# EAGLE design DigiDash (EAGLE 9.6.2)
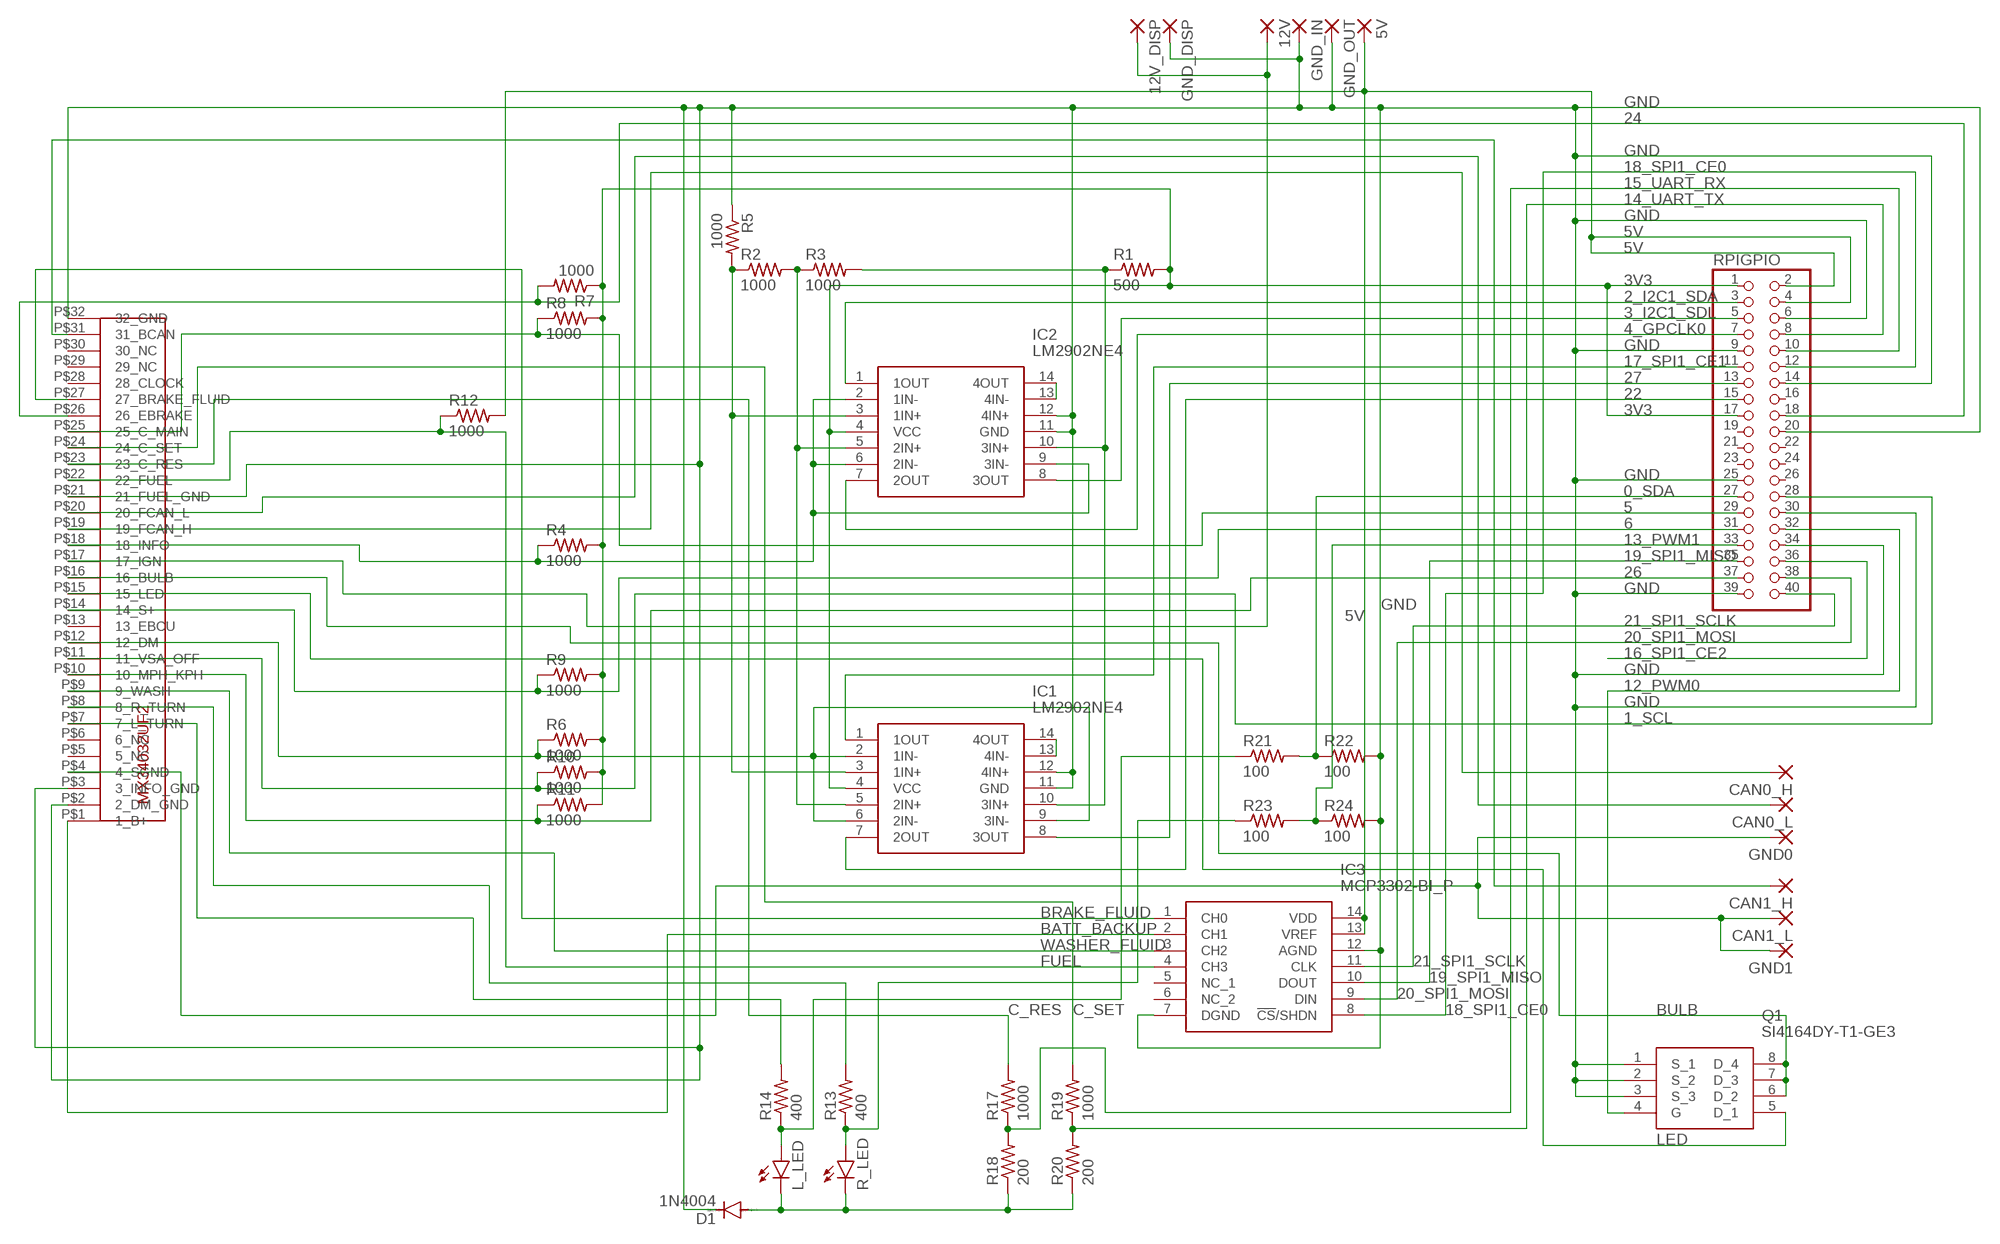
[diagram p0: schematic, sheet 1]

## Parts
5V  3,81/1,4  [3,81/1,4]
12V  3,81/1,4  [3,81/1,4]
12V_DISP  3,81/1,4  [3,81/1,4]
CAN0_H  3,81/1,4  [3,81/1,4]
CAN0_L  3,81/1,4  [3,81/1,4]
CAN1_H  3,81/1,4  [3,81/1,4]
CAN1_L  3,81/1,4  [3,81/1,4]
D1  1N4004  [DO41-10]
GND0  3,81/1,4  [3,81/1,4]
GND1  3,81/1,4  [3,81/1,4]
GND_DISP  3,81/1,4  [3,81/1,4]
GND_IN  3,81/1,4  [3,81/1,4]
GND_OUT  3,81/1,4  [3,81/1,4]
IC1  LM2902NE4  [DIP794W53P254L1930H508Q14N]
IC2  LM2902NE4  [DIP794W53P254L1930H508Q14N]
IC3  MCP3302-BI_P  [DIP781W56P254L1918H533Q14N]
L_LED  LED3MM  [LED3MM]
Q1  SI4164DY-T1-GE3  [SOIC127P600X175-8N]
R1  500  R-US_0204/7  [0204/7]
R2  1000  R-US_0204/7  [0204/7]
R3  1000  R-US_0204/7  [0204/7]
R4  1000  R-US_0204/7  [0204/7]
R5  1000  R-US_0204/7  [0204/7]
R6  1000  R-US_0204/7  [0204/7]
R7  1000  R-US_0204/7  [0204/7]
R8  1000  R-US_0204/7  [0204/7]
R9  1000  R-US_0204/7  [0204/7]
R10  1000  R-US_0204/7  [0204/7]
R11  1000  R-US_0204/7  [0204/7]
R12  1000  R-US_0204/7  [0204/7]
R13  400  R-US_0204/7  [0204/7]
R14  400  R-US_0204/7  [0204/7]
R17  1000  R-US_0204/7  [0204/7]
R18  200  R-US_0204/7  [0204/7]
R19  1000  R-US_0204/7  [0204/7]
R20  200  R-US_0204/7  [0204/7]
R21  100  R-US_0204/7  [0204/7]
R22  100  R-US_0204/7  [0204/7]
R23  100  R-US_0204/7  [0204/7]
R24  100  R-US_0204/7  [0204/7]
R_LED  LED3MM  [LED3MM]
RPIGPIO  PINHD-2X20  [2X20]
U$1  MX34032UF2  [MX34032UF2]

## Nets
0_SDA: R21.2 R22.1 RPIGPIO.27
1_SCL: R10.1 RPIGPIO.28 U$1.P$11(11_VSA_OFF)
2_I2C1_SDA: IC2.1(1OUT) RPIGPIO.3
3_I2C1_SDL: IC2.8(3OUT) RPIGPIO.5
3V3: IC1.4(VCC) IC2.4(VCC) R1.2 R4.2 R6.2 R7.1 R8.2 R9.2 R10.2 R11.2 RPIGPIO.1 RPIGPIO.17
4_GPCLK0: IC2.7(2OUT) RPIGPIO.7
5: R8.1 RPIGPIO.29 U$1.P$25(25_C_MAIN)
5V: 5V.1(P) IC3.13(VREF) IC3.14(VDD) R12.2 RPIGPIO.2 RPIGPIO.4
6: R9.1 RPIGPIO.31 U$1.P$14(14_S+)
12_PWM0: Q1.4(G) RPIGPIO.32
13_PWM1: R23.2 R24.1 RPIGPIO.33
14_UART_TX: R19.1 R20.2 RPIGPIO.8
15_UART_RX: R17.1 R18.2 RPIGPIO.10
16_SPI1_CE2: RPIGPIO.36
17_SPI1_CE1: IC1.1(1OUT) RPIGPIO.11
18_SPI1_CE0: IC3.8(!CS!/SHDN) RPIGPIO.12
19_SPI1_MISO: IC3.10(DOUT) RPIGPIO.35
20_SPI1_MOSI: IC3.9(DIN) RPIGPIO.38
21_SPI1_SCLK: IC3.11(CLK) RPIGPIO.40
22: IC1.7(2OUT) RPIGPIO.15
24: R7.2 RPIGPIO.18 U$1.P$26(26_EBRAKE)
26: R11.1 RPIGPIO.37 U$1.P$10(10_MPH_KPH)
27: IC1.8(3OUT) RPIGPIO.13
BATT_BACKUP: IC3.2(CH1) U$1.P$1(1_B+)
BRAKE_FLUID: IC3.1(CH0) U$1.P$27(27_BRAKE_FLUID)
BULB: Q1.6(D_2) Q1.7(D_3) Q1.8(D_4) U$1.P$16(16_BULB)
C_RES: R17.2 U$1.P$23(23_C_RES)
C_SET: R19.2 U$1.P$24(24_C_SET)
FUEL: IC3.4(CH3) R12.1 U$1.P$22(22_FUEL)
GND: D1.C GND_DISP.1(P) GND_IN.1(P) GND_OUT.1(P) IC1.11(GND) IC1.12(4IN+) IC2.11(GND) IC2.12(4IN+) IC3.7(DGND) IC3.12(AGND) Q1.1(S_1) Q1.2(S_2) Q1.3(S_3) R5.1 R22.2 R24.2 RPIGPIO.6 RPIGPIO.9 RPIGPIO.14 RPIGPIO.20 RPIGPIO.25 RPIGPIO.30 RPIGPIO.34 RPIGPIO.39 U$1.P$2(2_DM_GND) U$1.P$3(3_INFO_GND) U$1.P$21(21_FUEL_GND) U$1.P$32(32_GND)
LED: Q1.5(D_1) U$1.P$15(15_LED)
N$1: IC1.2(1IN-) IC1.6(2IN-) IC1.9(3IN-) R6.1 U$1.P$12(12_DM)
N$2: R14.2 U$1.P$7(7_L_TURN)
N$3: IC1.10(3IN+) IC2.10(3IN+) R1.1 R3.2
N$4: IC1.3(1IN+) IC2.3(1IN+) R2.1 R5.2
N$5: IC2.13(4IN-) IC2.14(4OUT)
N$6: IC1.5(2IN+) IC2.5(2IN+) R2.2 R3.1
N$7: IC1.13(4IN-) IC1.14(4OUT)
N$8: CAN1_H.1(P) U$1.P$31(31_BCAN)
N$9: CAN1_L.1(P) GND0.1(P) GND1.1(P) U$1.P$4(4_SGND)
N$10: CAN0_H.1(P) U$1.P$19(19_FCAN_H)
N$11: CAN0_L.1(P) U$1.P$20(20_FCAN_L)
N$12: R13.2 U$1.P$8(8_R_TURN)
N$13: IC2.2(1IN-) IC2.6(2IN-) IC2.9(3IN-) R4.1 U$1.P$18(18_INFO)
N$16: D1.A L_LED.K(C) R18.1 R20.1 R_LED.K(C)
N$17: 12V.1(P) 12V_DISP.1(P) U$1.P$17(17_IGN)
N$100: R13.1 R23.1 R_LED.A
N$101: L_LED.A R14.1 R21.1
WASHER_FLUID: IC3.3(CH2) U$1.P$9(9_WASH)
Unconnected: IC3.5(NC_1) IC3.6(NC_2) RPIGPIO.16 RPIGPIO.19 RPIGPIO.21 RPIGPIO.22 RPIGPIO.23 RPIGPIO.24 RPIGPIO.26 U$1.P$5(5_NC) U$1.P$6(6_NC) U$1.P$13(13_EBCU) U$1.P$28(28_CLOCK) U$1.P$29(29_NC) U$1.P$30(30_NC)

## Library data of the parts
5V 12V 12V_DISP CAN0_H CAN0_L CAN1_H CAN1_L GND0 GND1 GND_DISP GND_IN GND_OUT = wirepad:3,81/1,4: THROUGH-HOLE PAD
D1 = diode:1N4004: DIODE general purpose rectifier, 1 A
IC1 IC2 = SamacSys_Parts:LM2902NE4: Quadruple general-purpose operational amplifier Source: Datasheet <http://www.ti.com/lit/gpn/LM2902>; DESCRIPTION: Quadruple general-purpose operational amplifier<br />&nbsp;; HEIGHT: 5.08mm; MANUFACTURER_NAME: Texas Instruments; MANUFACTURER_PART_NUMBER: LM2902NE4; MOUSER_PART_NUMBER: 595-LM2902NE4; MOUSER_PRICE-STOCK: https://www.mouser.co.uk/ProductDetail/Texas-Instruments/LM2902NE4?qs=VBduBm9rCJQsy5MPoqo4Xw%3D%3D
IC3 = SamacSys_Parts:MCP3302-BI_P: Microchip MCP3302-BI/P, 13 bit Serial ADC, Differential Input, 14-Pin PDIP Source: Datasheet <https://ww1.microchip.com/downloads/aemDocuments/documents/APID/ProductDocuments/DataSheets/21697F.pdf>; ARROW_PART_NUMBER: MCP3302-BI/P; ARROW_PRICE-STOCK: https://www.arrow.com/en/products/mcp3302-bip/microchip-technology?region=nac; DESCRIPTION: Microchip MCP3302-BI/P, 13 bit Serial ADC, Differential Input, 14-Pin PDIP; HEIGHT: 5.334mm; MANUFACTURER_NAME: Microchip; MANUFACTURER_PART_NUMBER: MCP3302-BI/P; MOUSER_PART_NUMBER: 579-MCP3302-BI/P; MOUSER_PRICE-STOCK: https://www.mouser.co.uk/ProductDetail/Microchip-Technology/MCP3302-BI-P?qs=V0aAF6KYZrOlN7qFA8B5VA%3D%3D
L_LED R_LED = led:LED: LED OSRAM: - CHIPLED LG R971, LG N971, LY N971, LG Q971, LY Q971, LO R971, LY R971 LH N974, LH R974 LS Q976, LO Q976, LY Q976 LO Q996 - Hyper CHIPLED LW Q18S LB Q993, LB Q99A, LB R99A - SideLED LS A670, LO A670, LY A670, LG A670, LP A670 LB A673, LV A673, LT A673, LW A673 LH A674 LY A675 LS A676, LA A676, LO A676, LY A676, LW A676 LS A679, LY A679, LG A679 - Hyper Micro SIDELED® LS Y876, LA Y876, LO Y876, LY Y876 LT Y87S - SmartLED LW L88C, LW L88S LB L89C, LB L89S, LG L890 LS L89K, LO L89K, LY L89K LS L896, LA L896, LO L896, LY L896 - TOPLED LS T670, LO T670, LY T670, LG T670, LP T670 LSG T670, LSP T670, LSY T670, LOP T670, LYG T670 LG T671, LOG T671, LSG T671 LB T673, LV T673, LT T673, LW T673 LH T674 LS T676, LA T676, LO T676, LY T676, LB T676, LH T676, LSB T676, LW T676 LB T67C, LV T67C, LT T67C, LS T67K, LO T67K, LY T67K, LW E67C LS E67B, LA E67B, LO E67B, LY E67B, LB E67C, LV E67C, LT E67C LW T67C LS T679, LY T679, LG T679 LS T770, LO T770, LY T770, LG T770, LP T770 LB T773, LV T773, LT T773, LW T773 LH T774 LS E675, LA E675, LY E675, LS T675 LS T776, LA T776, LO T776, LY T776, LB T776 LHGB T686 LT T68C, LB T68C - Hyper Mini TOPLED® LB M676 - Mini TOPLED Santana® LG M470 LS M47K, LO M47K, LY M47K Source: http://www.osram.convergy.de LUXEON: - LUMILED® LXK2-PW12-R00, LXK2-PW12-S00, LXK2-PW14-U00, LXK2-PW14-V00 LXK2-PM12-R00, LXK2-PM12-S00, LXK2-PM14-U00 LXK2-PE12-Q00, LXK2-PE12-R00, LXK2-PE12-S00, LXK2-PE14-T00, LXK2-PE14-U00 LXK2-PB12-K00, LXK2-PB12-L00, LXK2-PB12-M00, LXK2-PB14-N00, LXK2-PB14-P00, LXK2-PB14-Q00 LXK2-PR12-L00, LXK2-PR12-M00, LXK2-PR14-Q00, LXK2-PR14-R00 LXK2-PD12-Q00, LXK2-PD12-R00, LXK2-PD12-S00 LXK2-PH12-R00, LXK2-PH12-S00 LXK2-PL12-P00, LXK2-PL12-Q00, LXK2-PL12-R00 Source: www.luxeon.com KINGBRIGHT: KA-3528ASYC Source: www.kingbright.com
Q1 = SamacSys_Parts:SI4164DY-T1-GE3: Vishay SI4164DY-T1-GE3 N-channel MOSFET Transistor, 30 A, 30 V, 8-Pin SOIC Source: Datasheet; DESCRIPTION: Vishay SI4164DY-T1-GE3 N-channel MOSFET Transistor, 30 A, 30 V, 8-Pin SOIC; HEIGHT: 1.75mm; MANUFACTURER_NAME: Vishay; MANUFACTURER_PART_NUMBER: SI4164DY-T1-GE3; MOUSER_PART_NUMBER: 781-SI4164DY-T1-GE3; MOUSER_PRICE-STOCK: https://www.mouser.co.uk/ProductDetail/Vishay-Semiconductors/SI4164DY-T1-GE3?qs=IRuQNBqMOcmOtrv2pb5m1A%3D%3D
R1-R14 R17-R24 = rcl:R-US_: RESISTOR, American symbol; SPICEPREFIX: R
RPIGPIO = pinhead:PINHD-2X20: PIN HEADER
U$1 = Custom:MX34032UF2

## Board
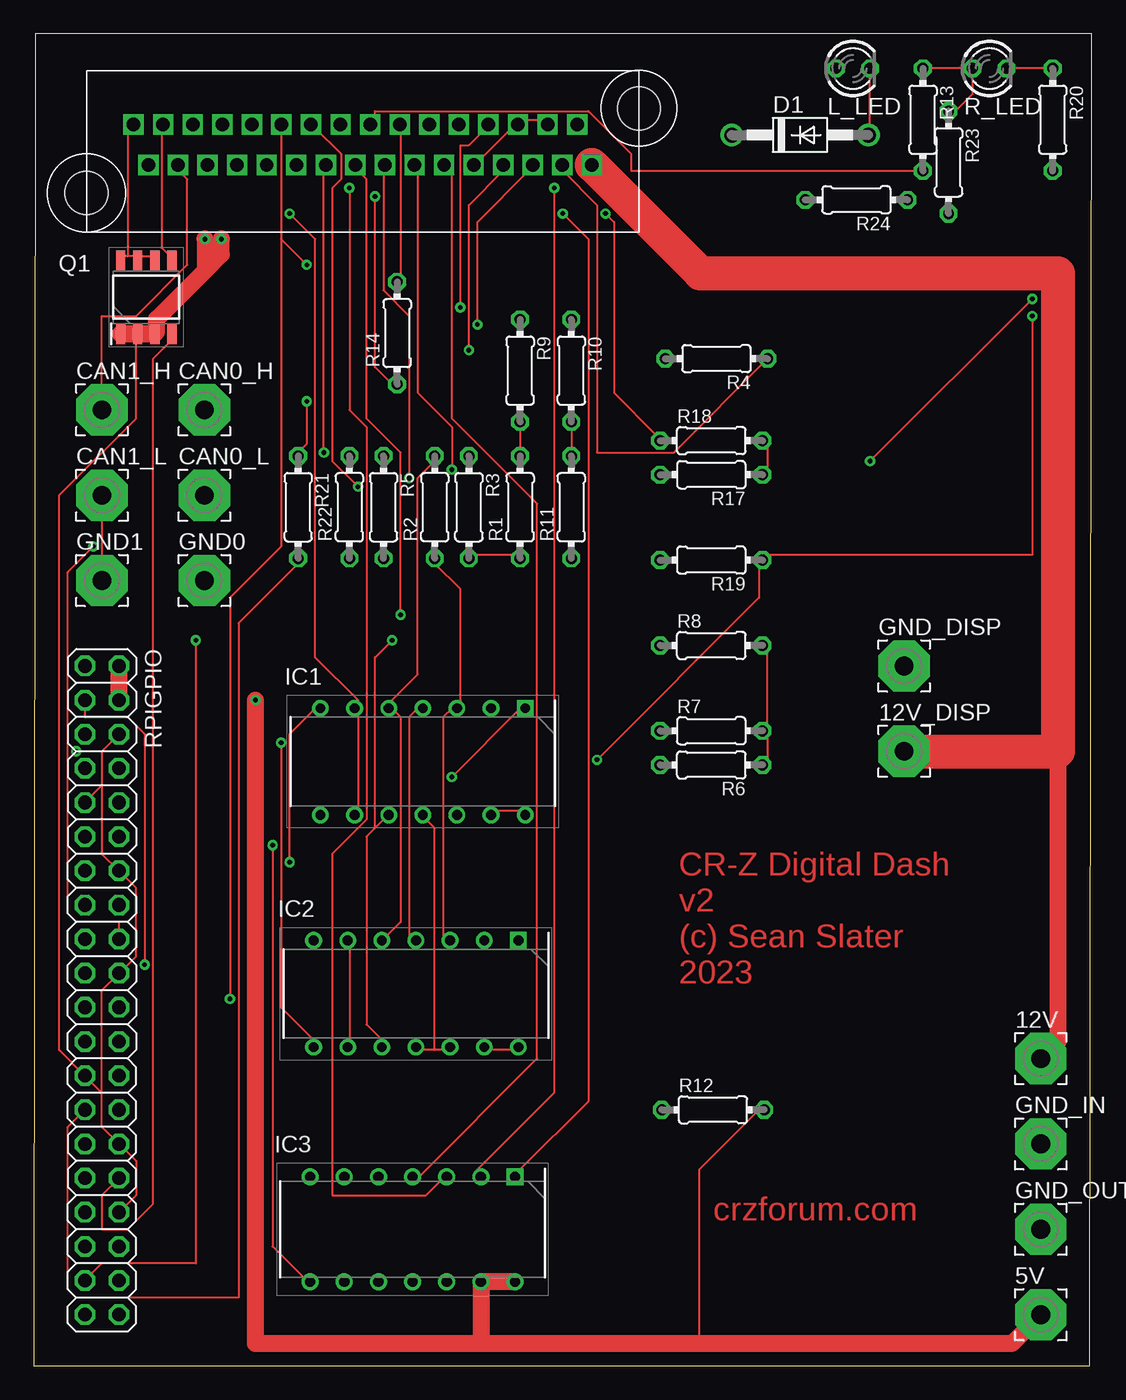
[diagram p1: board, top side]
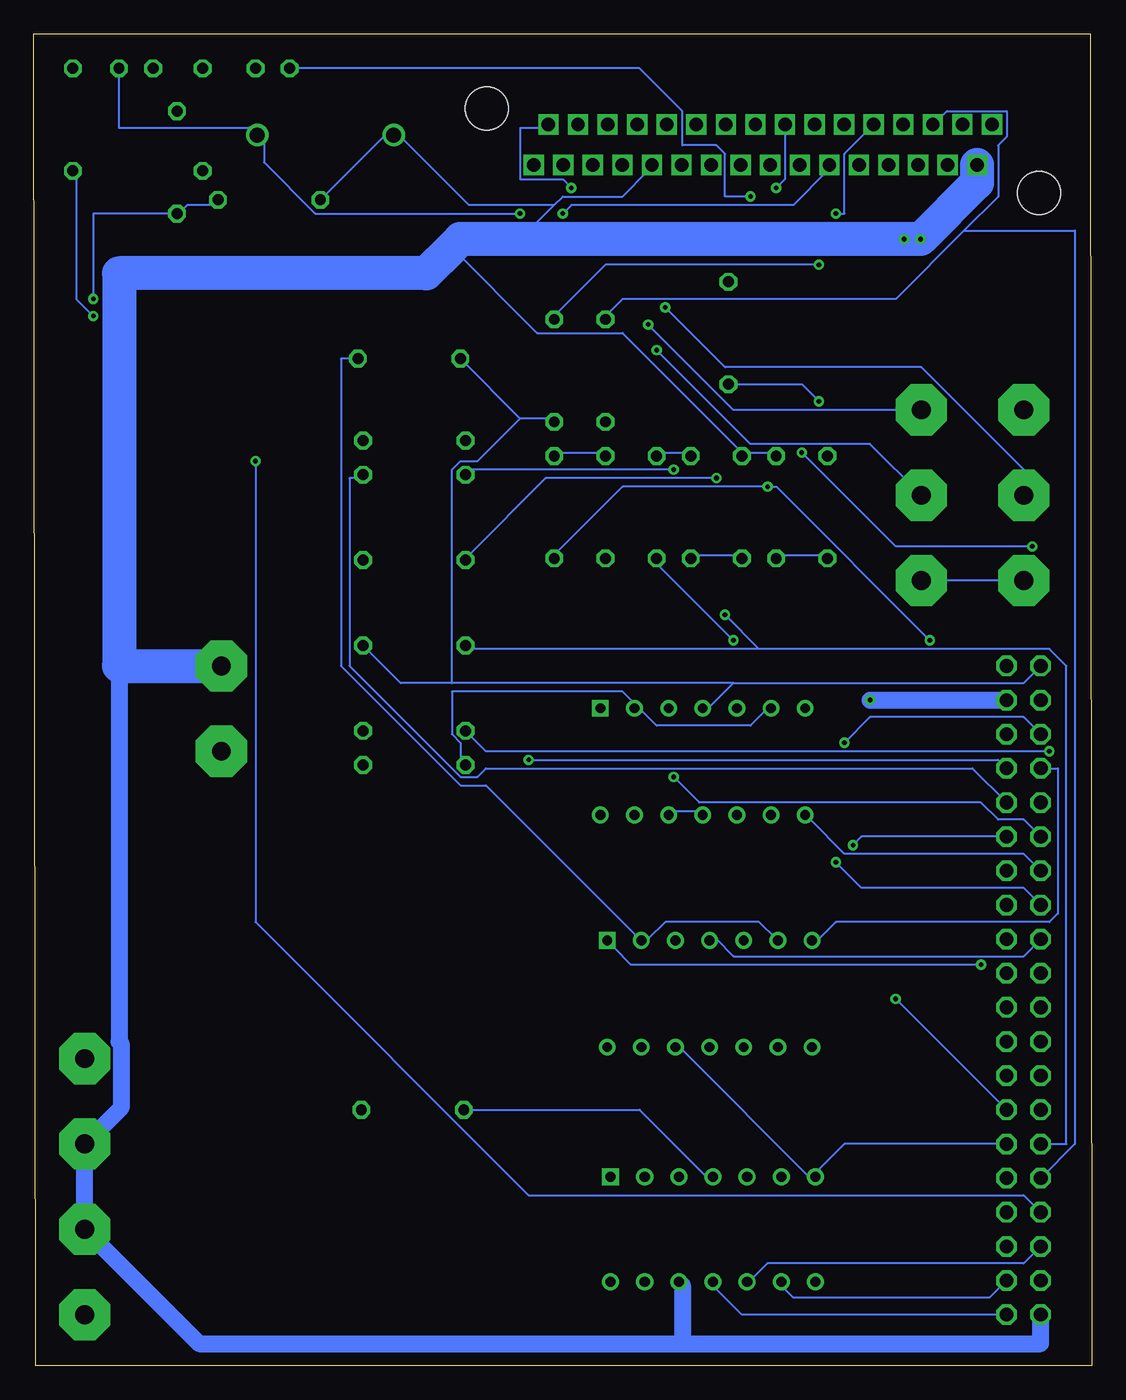
[diagram p2: board, bottom side, seen from below]

Size 78.72 x 99.11 mm. Coordinates in mm from the lower left corner, seen from the top.
Outline: 0,0 78.59,0 78.72,99.11 0.13,99.11 0,0
Copper layers (1*16): Top 0.035mm / dielectric 1.5mm / Bottom 0.035mm
Design rules "default": minimum track width 6mil, minimum drill 0.35mm, track to track 6mil, track to pad 6mil, pad to pad 6mil, via to via 6mil, smd to smd 6mil, copper to edge 40mil, drill to drill 6mil, minimum pad ring 10mil, minimum via ring 8mil, stop-mask expansion 4mil, vias tented up to drill 0mil, thermal gap 10mil

### Footprints (pad centres in the part's own frame; a part is rotated, then mirrored left to right if it is on the bottom)
3,81/1,4 = drill 1.397 pad 3.81 octagon: 1 0,0
DO41-10 = drill 1.118: A 5.08,0; C -5.08,0
DIP794W53P254L1930H508Q14N = drill 0.73 pad 1.13 square: 1 -3.97,7.62 | drill 0.73 pad 1.13: 2 -3.97,5.08; 3 -3.97,2.54; 4 -3.97,0; 5 -3.97,-2.54; 6 -3.97,-5.08; 7 -3.97,-7.62; 8 3.97,-7.62; 9 3.97,-5.08; 10 3.97,-2.54; 11 3.97,0; 12 3.97,2.54; 13 3.97,5.08; 14 3.97,7.62
DIP781W56P254L1918H533Q14N = drill 0.759 pad 1.159 square: 1 -3.905,7.62 | drill 0.759 pad 1.159: 2 -3.905,5.08; 3 -3.905,2.54; 4 -3.905,0; 5 -3.905,-2.54; 6 -3.905,-5.08; 7 -3.905,-7.62; 8 3.905,-7.62; 9 3.905,-5.08; 10 3.905,-2.54; 11 3.905,0; 12 3.905,2.54; 13 3.905,5.08; 14 3.905,7.62
LED3MM = drill 0.813 octagon: A -1.27,0; K 1.27,0
SOIC127P600X175-8N = smd 1.525 x 0.7: 1 -2.712,1.905; 2 -2.712,0.635; 3 -2.712,-0.635; 4 -2.712,-1.905; 5 2.712,-1.905; 6 2.712,-0.635; 7 2.712,0.635; 8 2.712,1.905
0204/7 = drill 0.813 octagon: 1 -3.81,0; 2 3.81,0
2X20 = drill 1.016 octagon: 1 -24.13,-1.27; 2 -24.13,1.27; 3 -21.59,-1.27; 4 -21.59,1.27; 5 -19.05,-1.27; 6 -19.05,1.27; 7 -16.51,-1.27; 8 -16.51,1.27; 9 -13.97,-1.27; 10 -13.97,1.27; 11 -11.43,-1.27; 12 -11.43,1.27; 13 -8.89,-1.27; 14 -8.89,1.27; 15 -6.35,-1.27; 16 -6.35,1.27; 17 -3.81,-1.27; 18 -3.81,1.27; 19 -1.27,-1.27; 20 -1.27,1.27; 21 1.27,-1.27; 22 1.27,1.27; 23 3.81,-1.27; 24 3.81,1.27; 25 6.35,-1.27; 26 6.35,1.27; 27 8.89,-1.27; 28 8.89,1.27; 29 11.43,-1.27; 30 11.43,1.27; 31 13.97,-1.27; 32 13.97,1.27; 33 16.51,-1.27; 34 16.51,1.27; 35 19.05,-1.27; 36 19.05,1.27; 37 21.59,-1.27; 38 21.59,1.27; 39 24.13,-1.27; 40 24.13,1.27
MX34032UF2 = drill 1 square: P$1 36.5,5.1; P$2 34.3,5.1; P$3 32.1,5.1; P$4 29.9,5.1; P$5 27.7,5.1; P$6 25.5,5.1; P$7 23.3,5.1; P$8 21.1,5.1; P$9 18.9,5.1; P$10 16.7,5.1; P$11 14.5,5.1; P$12 12.3,5.1; P$13 10.1,5.1; P$14 7.9,5.1; P$15 5.7,5.1; P$16 3.5,5.1; P$17 37.6,2.1; P$18 35.4,2.1; P$19 33.2,2.1; P$20 31,2.1; P$21 28.8,2.1; P$22 26.6,2.1; P$23 24.4,2.1; P$24 22.2,2.1; P$25 20,2.1; P$26 17.8,2.1; P$27 15.6,2.1; P$28 13.4,2.1; P$29 11.2,2.1; P$30 9,2.1; P$31 6.8,2.1; P$32 4.6,2.1 | hole 3.2: 41.1,6.3; 0,0

### Placement (x,y rotation side)
5V  74.93,3.81 0 top
12V  74.93,22.86 0 top
12V_DISP  64.77,45.72 0 top
CAN0_H  12.7,71.12 0 top
CAN0_L  12.7,64.77 0 top
CAN1_H  5.08,71.12 0 top
CAN1_L  5.08,64.77 0 top
D1  57.02,91.57 0 top
GND0  12.7,58.42 0 top
GND1  5.08,58.42 0 top
GND_DISP  64.77,52.07 0 top
GND_IN  74.93,16.51 0 top
GND_OUT  74.93,10.16 0 top
IC1  28.96,44.96 270 top
IC2  28.45,27.69 270 top
IC3  28.19,10.16 270 top
L_LED  60.96,96.52 0 top
Q1  8.38,79.5 90 top
R1  36.2,63.88 90 top
R2  29.84,63.88 90 top
R3  32.38,63.88 270 top
R4  50.8,74.93 180 top
R5  26.04,63.88 270 top
R6  50.42,44.7 0 top
R7  50.42,47.24 180 top
R8  50.42,53.59 0 top
R9  36.2,74.04 270 top
R10  40.01,74.04 270 top
R11  40.01,63.88 90 top
R12  50.55,19.05 0 top
R13  66.17,92.71 270 top
R14  27.05,76.83 90 top
R17  50.42,66.29 180 top
R18  50.42,68.83 0 top
R19  50.42,59.94 180 top
R20  75.82,92.71 270 top
R21  19.68,63.88 270 top
R22  23.5,63.88 90 top
R23  68.07,89.53 270 top
R24  61.21,86.74 180 top
R_LED  71.12,96.52 0 top
RPIGPIO  5.08,27.94 270 top
U$1  3.94,87.25 0 top

### Tracks (layer width: path | path; a pad name or v marks a point on that pad's centre or on a via)
0_SDA
  Top 0.152: RPIGPIO.27 2.54,17.78 2.54,5.71 3.17,5.08 15.24,5.08 15.24,55.24 19.68,59.69 R21.2
  Bottom 0.152: R21.2 19.68,60.33 23.5,60.33 R22.1
1_SCL  (via drill 0.35)
  Top 0.152: 18.41,83.82 v20.32,81.92 | 18.41,83.82 18.41,92.08 U$1.P$11 | v14.61,27.3 14.61,57.15 18.41,60.96 18.41,83.82
  Bottom 0.152: v20.32,81.92 36.2,81.92 40.01,78.11 R10.1 | v14.61,27.3 RPIGPIO.28
2_I2C1_SDA  (via drill 0.35)
  Top 0.152: v8.26,29.84 8.26,46.99 6.99,48.26 3.81,48.26 RPIGPIO.3
  Bottom 0.152: v8.26,29.84 34.29,29.84 35.56,31.11 IC2.1
3_I2C1_SDL  (via drill 0.35)
  Top 0.152: v18.41,46.35 18.41,26.67 20.95,24.13 IC2.8
  Bottom 0.152: v18.41,46.35 16.51,48.26 5.08,48.26 RPIGPIO.5
3V3
  Top 0.152: R9.2 R1.2 | R10.2 R11.2 | R6.2 54.61,45.09 54.61,46.99 R7.1 54.61,47.62 54.61,53.34 R8.2 | IC2.4 27.94,31.75 27.94,48.26 28.57,48.9 IC1.4
  Bottom 0.152: 42.55,70.48 R4.2 | 42.55,70.48 40.01,70.48 R10.2 | R1.2 36.2,67.94 40.01,67.94 R11.2 | RPIGPIO.17 5.08,30.48 26.67,30.48 27.94,31.75 IC2.4 | RPIGPIO.1 5.08,50.8 26.67,50.8 | 26.67,50.8 28.57,48.9 IC1.4 | R8.2 51.44,50.8 47.62,50.8 | 26.67,50.8 47.62,50.8 | 42.55,70.48 45.72,67.31 46.99,67.31 47.62,66.67 47.62,50.8
4_GPCLK0
  Bottom 0.152: RPIGPIO.7 2.54,44.45 2.54,33.66 3.17,33.02 19.05,33.02 20.32,31.75 IC2.7
5  (via drill 0.35)
  Top 0.152: v27.3,55.88 27.3,67.94 24.77,70.48 24.77,88.27 24.13,88.9 U$1.P$25
  Bottom 0.152: 24.77,53.34 3.17,53.34 1.91,52.07 1.91,16.51 RPIGPIO.29 | 24.77,53.34 46.35,53.34 R8.1 | 24.77,53.34 v27.3,55.88
5V  (via drill 0.35)
  Top 0.152: 49.53,1.65 49.53,14.61 53.98,19.05 R12.2
  Top 1.27: 5V.1 72.77,1.65 49.53,1.65 33.02,1.65 | IC3.14 IC3.13 33.27,1.91 33.02,1.65 | 33.02,1.65 16.51,1.65 v16.51,49.53 | RPIGPIO.4 RPIGPIO.2
  Bottom 1.27: v16.51,49.53 RPIGPIO.4
6
  Bottom 0.152: 9.53,84.45 6.99,87 6.99,90.81 6.35,91.44 6.35,93.34 10.79,93.34 11.43,92.71 U$1.P$14 | 9.53,84.45 14.61,79.38 34.92,79.38 36.2,78.11 R9.1 | RPIGPIO.31 1.27,16.51 1.27,84.45 9.53,84.45
12_PWM0
  Top 0.152: RPIGPIO.32 5.08,12.7 5.08,10.16 6.99,10.16 8.89,12.06 8.89,74.93 10.16,76.2 Q1.4
13_PWM1  (via drill 0.35)
  Top 0.152: v74.3,79.38 v62.23,67.31
  Bottom 0.152: R24.1 65.41,86.36 67.31,86.36 67.94,85.72 R23.2 74.3,85.72 v74.3,79.38 | RPIGPIO.33 5.08,12.7 41.91,12.7 62.23,33.02 v62.23,67.31
14_UART_TX  (via drill 0.35)
  Top 0.152: v74.3,78.11 74.3,60.33 54.61,60.33 R19.1 53.98,59.69 53.98,57.15 v41.91,45.09
  Bottom 0.152: v74.3,78.11 75.56,79.38 75.56,88.9 R20.2 | RPIGPIO.8 6.99,45.09 v41.91,45.09
15_UART_RX
  Top 0.152: R17.1 54.61,66.67 54.61,68.58 R18.2
  Bottom 0.152: RPIGPIO.10 8.89,44.45 45.09,44.45 45.72,43.81 46.99,43.81 55.24,52.07 55.24,66.04 54.61,66.04 R17.1
17_SPI1_CE1  (via drill 0.35)
  Top 0.152: v31.11,43.81 36.2,48.9 IC1.1
  Bottom 0.152: v31.11,43.81 29.21,41.91 8.26,41.91 6.99,40.64 5.08,40.64 RPIGPIO.11
18_SPI1_CE0  (via drill 0.35)
  Top 0.152: v17.78,38.73 17.78,8.89 20.32,6.35 IC3.8
  Bottom 0.152: v17.78,38.73 17.14,39.37 RPIGPIO.12
19_SPI1_MISO
  Bottom 0.152: RPIGPIO.35 5.08,7.62 24.13,7.62 25.4,6.35 IC3.10
20_SPI1_MOSI
  Bottom 0.152: RPIGPIO.38 7.62,5.08 22.23,5.08 22.86,5.71 IC3.9
21_SPI1_SCLK
  Bottom 0.152: RPIGPIO.40 26.04,3.81 27.94,5.71 IC3.11
22  (via drill 0.35)
  Top 0.152: v19.05,37.47 19.05,46.99 20.95,48.9 IC1.7
  Bottom 0.152: v19.05,37.47 17.14,35.56 5.08,35.56 RPIGPIO.15
24  (via drill 0.35)
  Top 0.152: 2.54,45.09 v3.17,45.72 | 2.54,45.09 2.54,33.66 3.17,33.02 6.35,33.02 RPIGPIO.18 | v21.59,67.94 21.59,88.9 U$1.P$26 | v4.45,60.96 2.54,59.05 2.54,45.09
  Bottom 0.152: R7.2 45.09,45.72 v3.17,45.72 | v21.59,67.94 14.61,60.96 v4.45,60.96
26  (via drill 0.35)
  Top 0.152: v24.13,65.41 22.23,67.31 22.23,87.63 22.86,88.27 22.86,90.17 20.95,92.08 U$1.P$10 | RPIGPIO.37 5.08,7.62 12.06,7.62 v12.06,53.98
  Bottom 0.152: R11.1 40.01,60.33 34.92,65.41 v24.13,65.41 23.5,65.41 v12.06,53.98
27
  Bottom 0.152: RPIGPIO.13 5.08,38.1 18.41,38.1 20.95,40.64 IC1.8
BATT_BACKUP  (via drill 0.35)
  Top 0.152: v38.73,87.63 38.73,20.32 33.02,14.61 IC3.2
  Bottom 0.152: v38.73,87.63 39.37,88.27 42.55,88.27 42.55,92.08 40.64,92.08 U$1.P$1
BRAKE_FLUID  (via drill 0.35)
  Top 0.152: v39.37,85.72 41.27,83.82 41.27,19.68 36.2,14.61 IC3.1
  Bottom 0.152: v39.37,85.72 38.73,86.36 22.23,86.36 19.68,88.9 U$1.P$27
BULB
  Top 0.152: 7.62,82.55 6.99,82.55 | 6.99,82.55 6.35,82.55 Q1.8 | 7.62,82.55 8.89,82.55 Q1.6 | 7.62,82.55 Q1.7 | 6.99,82.55 6.99,92.08 U$1.P$16
C_RES  (via drill 0.35)
  Top 0.152: v31.11,66.67 31.11,69.85 28.57,72.39 28.57,88.9 U$1.P$23
  Bottom 0.152: v31.11,66.67 46.35,66.67 R17.2
C_SET  (via drill 0.35)
  Top 0.152: v27.94,66.04 27.94,78.11 26.04,80.01 26.04,88.9 U$1.P$24
  Bottom 0.152: v27.94,66.04 40.64,66.04 46.35,60.33 R19.2
FUEL
  Top 0.152: U$1.P$22 31.11,88.9 31.11,70.48 37.47,64.14 37.47,22.86 28.57,13.97 IC3.4
  Bottom 0.152: R12.1 33.66,19.05 28.57,13.97 IC3.4
GND  (via drill 0.35)
  Top 0.152: U$1.P$21 33.02,89.53 35.56,92.08 U$1.P$3 36.2,92.71 38.1,92.71 U$1.P$2 | 29.84,23.5 30.48,23.5 IC2.12 | 29.84,23.5 28.57,23.5 IC2.11 | 29.84,23.5 29.84,40.01 29.21,40.64 IC1.11 | 5.08,43.18 RPIGPIO.9 | 5.08,43.18 5.08,45.72 RPIGPIO.6 | 5.08,43.18 5.08,38.1 RPIGPIO.14 7.62,35.56 7.62,30.48 RPIGPIO.20 5.08,27.94 5.08,20.32 | 5.08,20.32 RPIGPIO.25 1.91,23.5 1.91,64.77 7.62,70.48 7.62,76.2 Q1.2 | 5.08,20.32 5.08,17.78 RPIGPIO.30 7.62,15.24 7.62,12.7 RPIGPIO.34
  Top 1.27: Q1.1 Q1.2 Q1.3 9.15,76.92 9.15,77.88 12.75,81.47 | v12.75,83.82 12.75,81.47 | 12.75,81.47 13.97,82.7 v13.97,83.82
  Bottom 0.152: R24.2 52.7,91.44 52.07,91.44 D1.C 51.44,91.44 46.35,86.36 40.01,86.36 | 26.04,67.94 23.5,67.94 R22.2 | 26.04,67.94 34.92,76.83 41.27,76.83 47.62,83.19 | 26.04,67.94 R5.1 | 40.01,86.36 41.91,84.45 41.91,83.82 | 40.01,86.36 39.37,87 34.92,87 33.02,88.9 U$1.P$21 | IC1.11 29.21,41.27 31.11,41.27 IC1.12 | IC2.12 30.48,23.5 20.95,13.97 IC3.7 20.32,14.61 18.41,16.51 RPIGPIO.30
  Bottom 1.27: 72.39,52.07 72.39,24.13 72.24,23.98 72.24,19.2 GND_IN.1 GND_OUT.1 66.42,1.65 30.48,1.65 | 30.48,1.65 30.48,6 IC3.12 | 30.48,1.65 3.81,1.65 RPIGPIO.39
  Bottom 2.54: U$1.P$32 8.56,89.33 8.56,88.01 v12.75,83.82 v13.97,83.82 41.91,83.82 46.99,83.82 47.62,83.19 49.53,81.28 72.39,81.28 72.39,52.07 GND_DISP.1
LED
  Top 0.152: Q1.5 10.16,82.55 9.53,83.19 9.53,92.08 U$1.P$15
N$1  (via drill 0.35)
  Top 0.152: IC1.9 24.13,41.27 24.13,48.9 IC1.6 24.13,49.53 20.95,52.7 20.95,83.82 v19.05,85.72
  Bottom 0.152: IC1.6 24.13,48.9 25.4,47.62 32.38,47.62 33.66,48.9 IC1.2 34.29,49.53 34.92,50.16 47.62,50.16 47.62,46.99 46.99,46.35 46.99,45.09 R6.1 | v19.05,85.72 18.41,85.72 18.41,90.17 16.51,92.08 U$1.P$12
N$2
  Top 0.152: R14.2 27.3,80.64 27.3,92.08 U$1.P$7
N$3  (via drill 0.35)
  Top 0.152: R3.2 32.38,60.33 36.2,60.33 R1.1 | 25.4,40.01 26.04,40.64 IC1.10 | 25.4,40.01 24.77,39.37 24.77,25.4 26.04,24.13 IC2.10 | v26.67,53.98 25.4,52.7 25.4,40.01
  Bottom 0.152: v26.67,53.98 32.38,59.69 R3.2
N$4
  Top 0.152: IC2.3 30.48,31.75 30.48,48.26 31.11,48.9 IC1.3 31.75,49.53 31.75,57.78 29.84,59.69 R2.1
  Bottom 0.152: R5.2 26.04,60.33 29.84,60.33 R2.1
N$5
  Top 0.152: IC2.13 33.66,23.5 35.56,23.5 IC2.14
N$6
  Top 0.152: IC2.5 26.04,31.75 27.3,33.02 27.3,48.26 26.67,48.9 IC1.5 26.67,49.53 28.57,51.44 28.57,66.04 29.84,67.31 R2.2
  Bottom 0.152: R2.2 29.84,67.94 32.38,67.94 R3.1
N$7
  Top 0.152: IC1.13 34.29,41.27 36.2,41.27 IC1.14
N$8
  Top 0.152: CAN1_H.1 5.08,78.11 7.62,78.11 11.43,81.92 11.43,88.27 10.79,88.9 U$1.P$31
N$9  (via drill 0.35)
  Top 0.152: v31.75,78.74 31.75,90.81 32.38,90.81 33.66,92.08 U$1.P$4 | CAN1_L.1 GND1.1
  Bottom 0.152: v31.75,78.74 27.3,74.3 12.7,74.3 5.08,66.67 CAN1_L.1 | GND1.1 GND0.1
N$10  (via drill 0.35)
  Top 0.152: v33.02,77.47 33.02,85.09 36.83,88.9 U$1.P$19
  Bottom 0.152: v33.02,77.47 26.67,71.12 CAN0_H.1
N$11  (via drill 0.35)
  Top 0.152: v32.38,75.56 32.38,86.36 34.92,88.9 U$1.P$20
  Bottom 0.152: v32.38,75.56 25.4,68.58 16.51,68.58 CAN0_L.1
N$12
  Top 0.152: R13.2 44.45,88.9 44.45,90.17 41.27,93.34 25.4,93.34 25.4,92.71 U$1.P$8
N$13
  Top 0.152: IC2.9 23.5,24.13 23.5,31.11 IC2.6 | R4.1 47.62,67.94 41.91,67.94 41.91,86.36 39.37,88.9 U$1.P$18
  Bottom 0.152: IC2.6 23.5,31.75 24.77,33.02 31.75,33.02 33.02,31.75 IC2.2 33.66,31.75 45.09,43.18 46.99,43.18 55.88,52.07 55.88,74.93 R4.1
N$16  (via drill 0.35)
  Top 0.152: R20.1 R_LED.K | v42.55,85.72 43.18,85.09 43.18,72.39 46.35,69.22 R18.1 | L_LED.K 62.23,92.08 D1.A
  Bottom 0.152: v42.55,85.72 57.78,85.72 61.59,89.53 61.59,91.44 D1.A 62.23,92.08 72.39,92.08 R_LED.K
N$17
  Top 1.27: 76.2,45.72 76.2,24.13 12V.1
  Top 2.54: U$1.P$17 49.61,81.28 76.2,81.28 76.2,45.72 12V_DISP.1
N$100
  Top 0.152: R23.1 68.58,93.34 69.85,94.61 R_LED.A R13.1
N$101  (via drill 0.35)
  Top 0.152: v20.32,71.75 20.32,68.58 19.68,67.94 R21.1 | v25.4,87 25.4,74.3 26.67,73.03 R14.1
  Bottom 0.152: v20.32,71.75 21.59,73.03 R14.1 | L_LED.A 33.66,96.52 30.48,93.34 30.48,90.81 27.94,90.81 27.3,90.17 27.3,87 v25.4,87
WASHER_FLUID  (via drill 0.35)
  Top 0.152: v23.5,87.63 23.5,71.12 24.77,69.85 24.77,40.64 22.23,38.1 22.23,12.7 29.21,12.7 30.48,13.97 IC3.3
  Bottom 0.152: v23.5,87.63 22.86,88.27 22.86,92.08 U$1.P$9

### Text on the board
Top: CR-Z Digital Dash / v2 / (c) Sean Slater / 2023 | crzforum.com